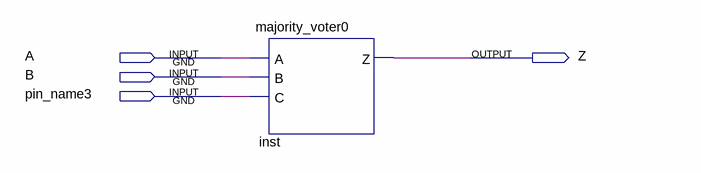
[diagram p0: schematic sheet]
// Quartus schematic majority_voter0-symbol.bdf as structural Verilog: 1 symbols, 4 pins
module \majority_voter0-symbol  (
  input  A,
  input  B,
  input  pin_name3,
  output Z
);

  majority_voter0 inst (.A(A), .B(B), .C(pin_name3), .Z(Z));
endmodule
